# EAGLE design servoController (EAGLE 9.6.2)
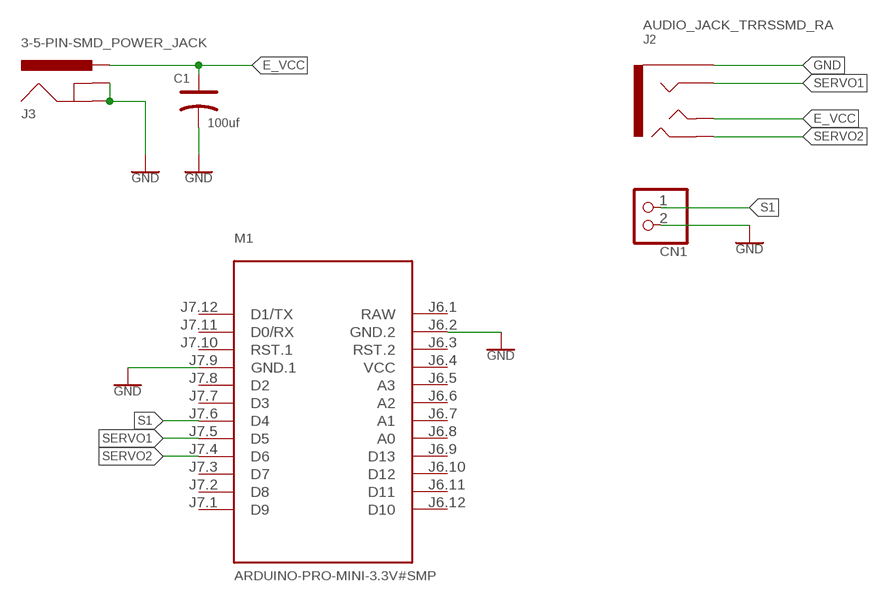
[diagram p0: schematic, sheet 1]

## Parts
C1  100uf  DIP-ALUMINUM-47UF-16V(D5-H7MM)  [PC-D5.3MM]
CN1  ARDUINO_3V_TTL_INTERFACE_2_PI_ADAFRUIT_JST_2PIN-SMT-RA  [ARDUINO_3V_TTL_INTERFACE_2_PI_ADAFRUIT_JST-PH-2-SMT-RA]
J2  AUDIO_JACK_TRRSSMD_RA  [AUDIO_JACK_3.5MM_TRRS_SMD_RA]
J3  3-5-PIN-SMD_POWER_JACK  [3-5-PIN-SMD_POWER_JACK_PTH]
M1  ARDUINO-PRO-MINI-3.3V#SMP  [ARDUINO-PRO-MINI#SMP]

## Nets
E_VCC: C1.+ J2.TIP J3.PWR
GND: C1.- CN1.2 J2.EARTH J3.GND J3.GNDBREAK M1.J6.2(GND.2) M1.J7.9(GND.1)
S1: CN1.1 M1.J7.6(D4)
SERVO1: J2.RING1 M1.J7.5(D5)
SERVO2: J2.RING2 M1.J7.4(D6)
Unconnected: M1.J6.3(RST.2) M1.J6.5(A3) M1.J6.6(A2) M1.J6.7(A1) M1.J6.8(A0) M1.J6.9(D13) M1.J6.10(D12) M1.J6.11(D11) M1.J6.12(D10) M1.J7.1(D9) M1.J7.2(D8) M1.J7.3(D7) M1.J7.7(D3) M1.J7.8(D2) M1.J7.10(RST.1) M1.J7.11(D0/RX) M1.J7.12(D1/TX)

## Power pins joined to a net without a drawn wire
RAW: M1.J6.1(RAW)
VCC: M1.J6.4(VCC)

## Library data of the parts
C1 = servoController:DIP-ALUMINUM-47UF-16V(D5-H7MM): 302030033; MPN: KS 100uF/16V
CN1 = servoController:ARDUINO_3V_TTL_INTERFACE_2_PI_ADAFRUIT_JST_2PIN: JST 2-Pin Connectors of various flavors SMT-RA (S2B-PH-SM4) 4UConnector #17311 SMT (B2B-PH-SM4) THM-RA (S2B-PH) THM (B2B-PH)
J2 = servoController:AUDIO_JACK_TRRS: Audio Jack - 3.5mm TRRS (SMD) This is a 3.5mm TRRS SMD audio jack. TRRS connectors are the audio-style connectors that you see on some phones, MP3 players and development boards. TRRS stands for “tip, ring, ring, sleeve,” which reflects that this has three conductors and a ground. SparkFun Products: Audio Jack <https://www.sparkfun.com/products/12639> mbed Starter Kit <https://www.sparkfun.com/products/12968> SparkFun TRRS 3.5mm Jack Breakout <https://www.sparkfun.com/products/11570>; PROD_ID: CONN-10676; SF_ID: PRT-12639
J3 = servoController:3-5-PIN-SMD_POWER_JACK: Power Jack Connector This is the standard 5.5mm barrel jack for power. The PTH is the most common, proven, reliable, footprint. The Slot footprint only works if the mill layer is transmitted to the PCB fab house so be warned. Here are the connectors we sell at SparkFun: DC Barrel Power Jack/Connector <https://www.sparkfun.com/products/119> (PRT-00119) DC Barrel Power Jack/Connector (SMD) <https://www.sparkfun.com/products/12748> (PRT-12748) DC Barrel Jack Adapter - Breadboard Compatible <https://www.sparkfun.com/products/10811> (PRT-10811) It is used on this SparkFun product (and many, many others): SparkFun RedBoard - Programmed with Arduino <https://www.sparkfun.com/products/12757> (DEV-12757) Also, if you need a mating power supply or connector, please check these out: Wall Adapter Power Supply - 9VDC 650mA <https://www.sparkfun.com/products/298> (TOL-00298) DC Barrel Jack Adapter - Male <https://www.sparkfun.com/products/10287> (PRT-10287); PROD_ID: CONN-08197
M1 = servoController:ARDUINO-PRO-MINI-*#SMP: Arduino Pro Mini (and compatible devices) with 2 connectors only More details available here: https://www.arduino.cc/en/Main/ArduinoBoardProMini Click here to find device on ebay.com <http://www.ebay.com/sch/arduino+pro+mini>

## Board
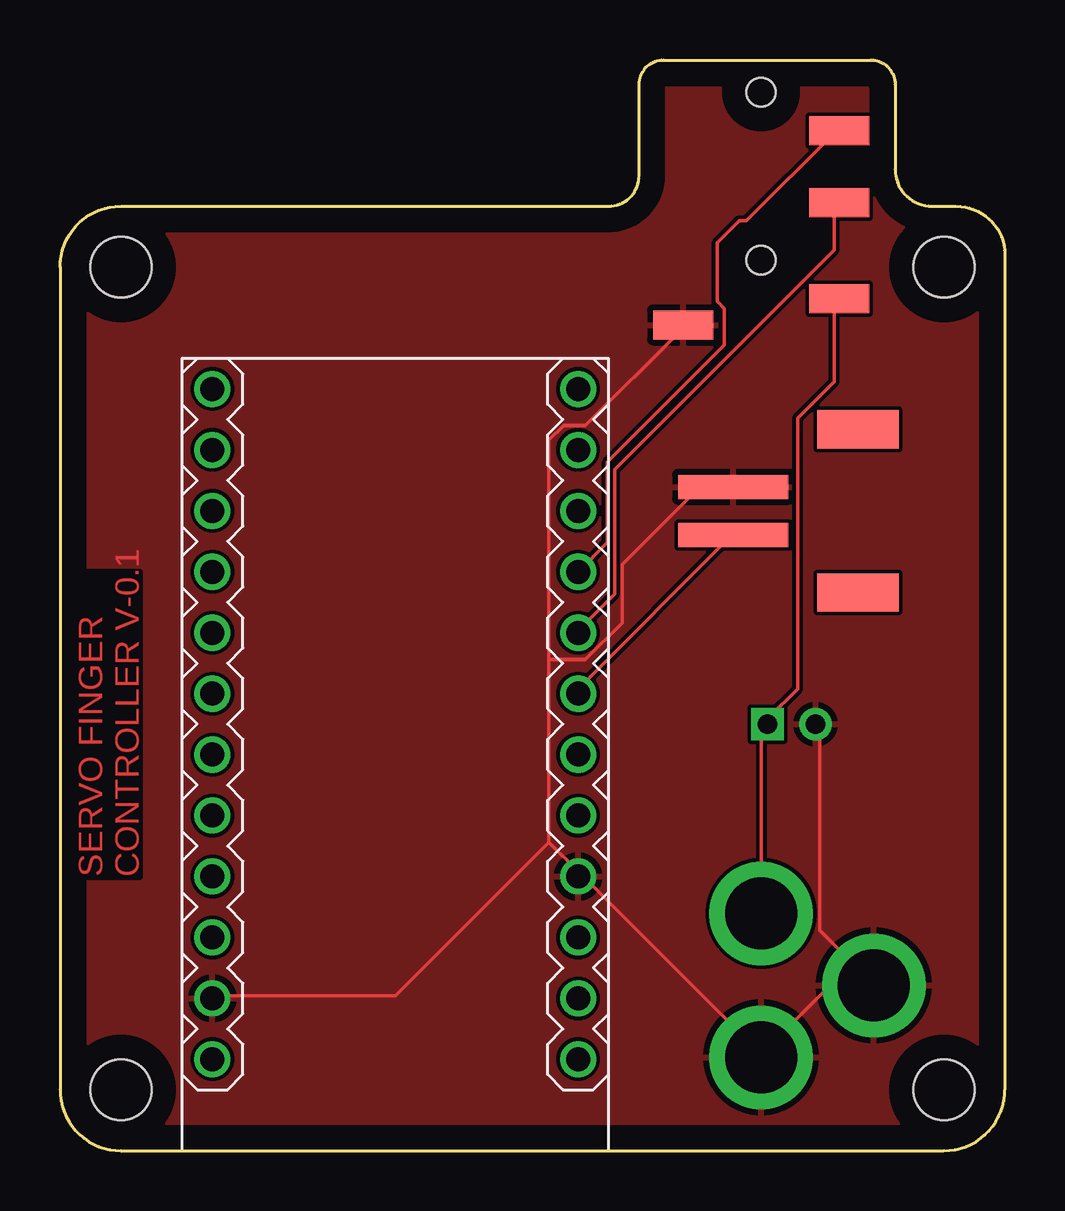
[diagram p1: board, top side]
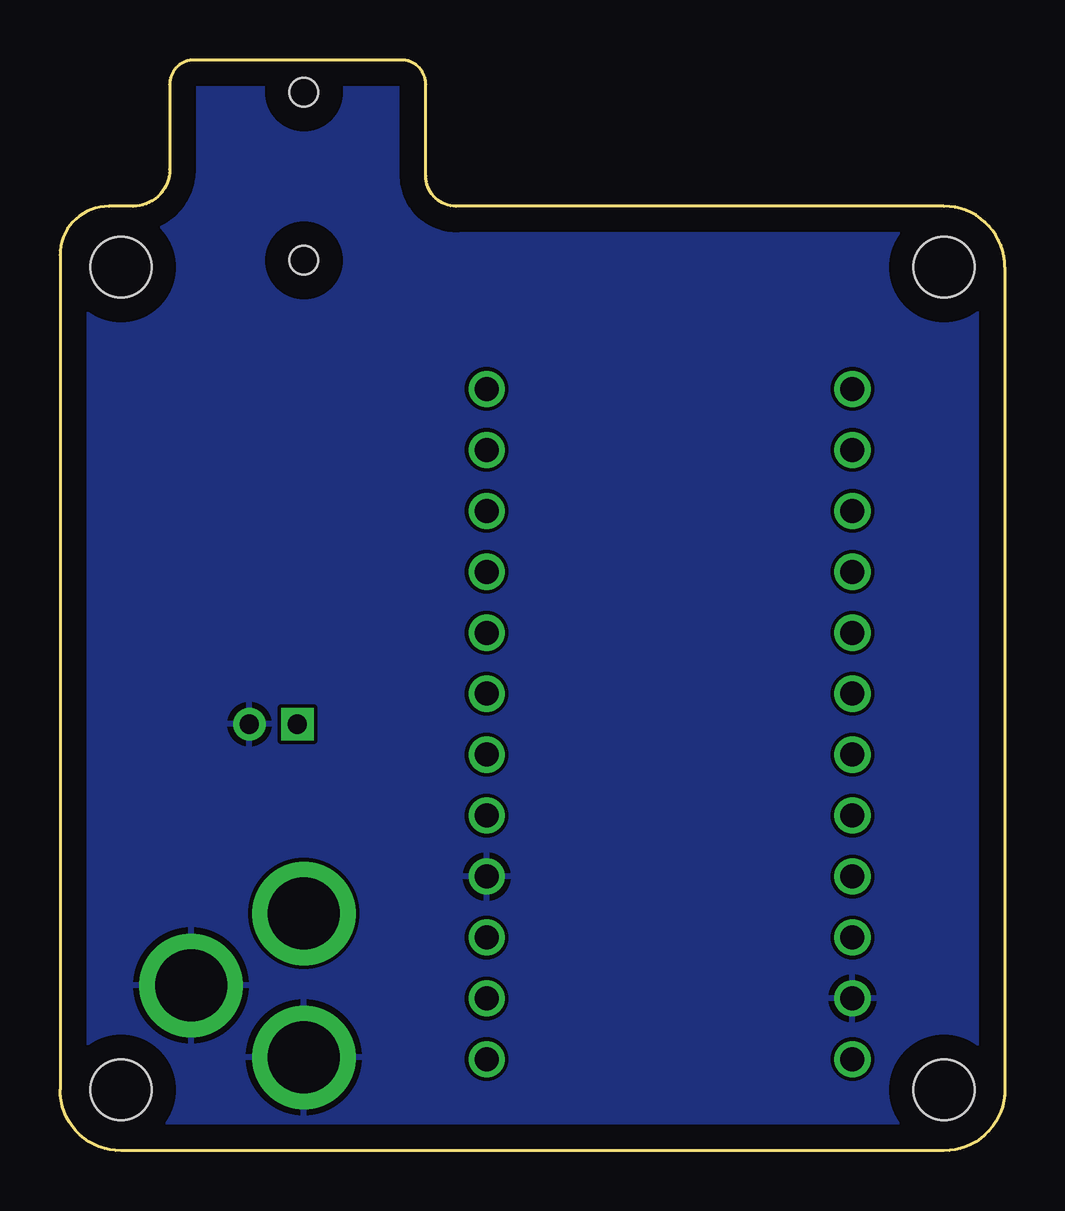
[diagram p2: board, bottom side, seen from below]

Size 39.37 x 45.47 mm. Coordinates in mm from the lower left corner, seen from the top.
Outline: 0,36.83 arc-90 2.54,39.37 22.86,39.37 arc90 24.13,40.64 24.13,44.45 arc-90 25.15,45.47 33.78,45.47 arc-90 34.8,44.45 34.8,40.89 arc90 36.32,39.37 37.34,39.37 arc-90 39.37,37.34 39.37,2.54 arc-90 36.83,0 2.54,0 arc-90 0,2.54 0,36.83
Copper layers (1*16): Top 0.035mm / dielectric 1.5mm / Bottom 0.035mm
Design rules "default": minimum track width 6mil, minimum drill 0.35mm, track to track 6mil, track to pad 6mil, pad to pad 6mil, via to via 6mil, smd to smd 6mil, copper to edge 40mil, drill to drill 6mil, minimum pad ring 10mil, minimum via ring 8mil, stop-mask expansion 4mil, vias tented up to drill 0mil, thermal gap 10mil
Holes 2.54 mm at 36.83,36.83 36.83,2.54 2.54,36.83 2.54,2.54

### Footprints (pad centres in the part's own frame; a part is rotated, then mirrored left to right if it is on the bottom)
PC-D5.3MM = drill 0.8 pad 1.35 square: + -1,0 | drill 0.8 pad 1.35: - 1,0
ARDUINO_3V_TTL_INTERFACE_2_PI_ADAFRUIT_JST-PH-2-SMT-RA = smd 1 x 4.6: 1 1,-3.7; 2 -1,-3.7 | smd 1.6 x 3.4: NC1 -3.4,1.5; NC2 3.4,1.5
AUDIO_JACK_3.5MM_TRRS_SMD_RA = smd 1.2 x 2.5: EARTH 11.3,-3.25; RING1 6.2,3.25; RING2 3.2,3.25; TIP 10.2,3.25 | hole 1.2: 1.6,0; 8.6,0
3-5-PIN-SMD_POWER_JACK_PTH = drill 2.997 pad 4.318: GND 0,7.7; GNDBREAK 4.7,10.7; PWR 0,13.7
ARDUINO-PRO-MINI#SMP = drill 1: J6.1 -12.7,7.62; J6.2 -10.16,7.62; J6.3 -7.62,7.62; J6.4 -5.08,7.62; J6.5 -2.54,7.62; J6.6 0,7.62; J6.7 2.54,7.62; J6.8 5.08,7.62; J6.9 7.62,7.62; J6.10 10.16,7.62; J6.11 12.7,7.62; J6.12 15.24,7.62; J7.1 15.24,-7.62; J7.2 12.7,-7.62; J7.3 10.16,-7.62; J7.4 7.62,-7.62; J7.5 5.08,-7.62; J7.6 2.54,-7.62; J7.7 0,-7.62; J7.8 -2.54,-7.62; J7.9 -5.08,-7.62; J7.10 -7.62,-7.62; J7.11 -10.16,-7.62; J7.12 -12.7,-7.62

### Placement (x,y rotation side)
C1  30.48,17.78 0 top
CN1  31.75,26.67 270 top
J2  29.21,45.72 270 top
J3  29.21,-3.81 0 top
M1  13.97,16.51 90 top

### Tracks (layer width: path | path; a pad name or v marks a point on that pad's centre or on a via)
E_VCC
  Top 0.152: J2.TIP 32.26,35.41 32.26,32.05 30.73,30.53 30.73,19.25 29.52,18.03 C1.+ 29.21,17.73 J3.PWR
GND
  Top 0.152: 32.87,7.98 33.78,7.06 J3.GNDBREAK 32.87,7.98 | 32.87,7.98 31.65,9.2 31.65,17.73 C1.- | 29.21,4.01 32.87,7.67 32.87,7.98 | 20.37,12.85 20.37,20.47 | 20.37,20.47 20.37,29.62 20.98,30.23 21.89,30.23 25.86,34.19 J2.EARTH | 21.59,11.63 20.37,12.85 | 20.37,12.85 13.97,6.45 6.35,6.45 M1.J6.2 | 20.37,20.47 21.89,20.47 23.42,22 23.42,24.43 26.47,27.48 27.99,27.48 CN1.2 | 21.59,11.63 29.21,4.01 | 29.21,4.01 J3.GND | 21.59,11.63 M1.J7.9
  pour Top: 23.62,44.96 23.62,40.89 arc-90 22.1,39.37 0.25,39.37 arc90 -0.76,38.35 -0.76,2.29 arc90 2.29,-0.76 36.32,-0.76 arc90 39.88,2.79 39.88,5.33 39.88,37.34 arc90 37.34,39.88 36.32,39.88 arc-90 35.31,40.89 35.31,41.91 35.31,44.45 arc90 33.78,45.97 32.77,45.97 26.67,45.97 24.64,45.97 arc90
  pour Bottom: 24.13,45.47 arc90 23.62,44.96 23.62,40.39 arc-90 23.11,39.88 0.76,39.88 arc90 -1.27,37.85 -1.27,2.29 arc90 2.29,-1.27 13.46,-1.27 38.35,-1.27 arc90 39.88,0.25 39.88,37.85 arc90 37.34,40.39 36.32,40.39 arc-90 35.31,41.4 35.31,44.45 arc90 33.78,45.97 25.15,45.97 arc-90 24.64,45.47
S1
  Top 0.152: M1.J7.6 21.59,19.25 27.99,25.65 CN1.1
SERVO1
  Top 0.152: J2.RING1 32.26,39.37 32.26,37.54 23.11,28.4 23.11,23.22 21.59,21.69 M1.J7.5
SERVO2
  Top 0.152: M1.J7.4 22.81,25.35 22.81,28.7 27.69,33.58 27.69,35.1 27.38,35.41 27.38,37.85 28.3,38.76 28.6,38.76 32.26,42.42 J2.RING2

### Text on the board
Top: SERVO FINGER / CONTROLLER V-0.1